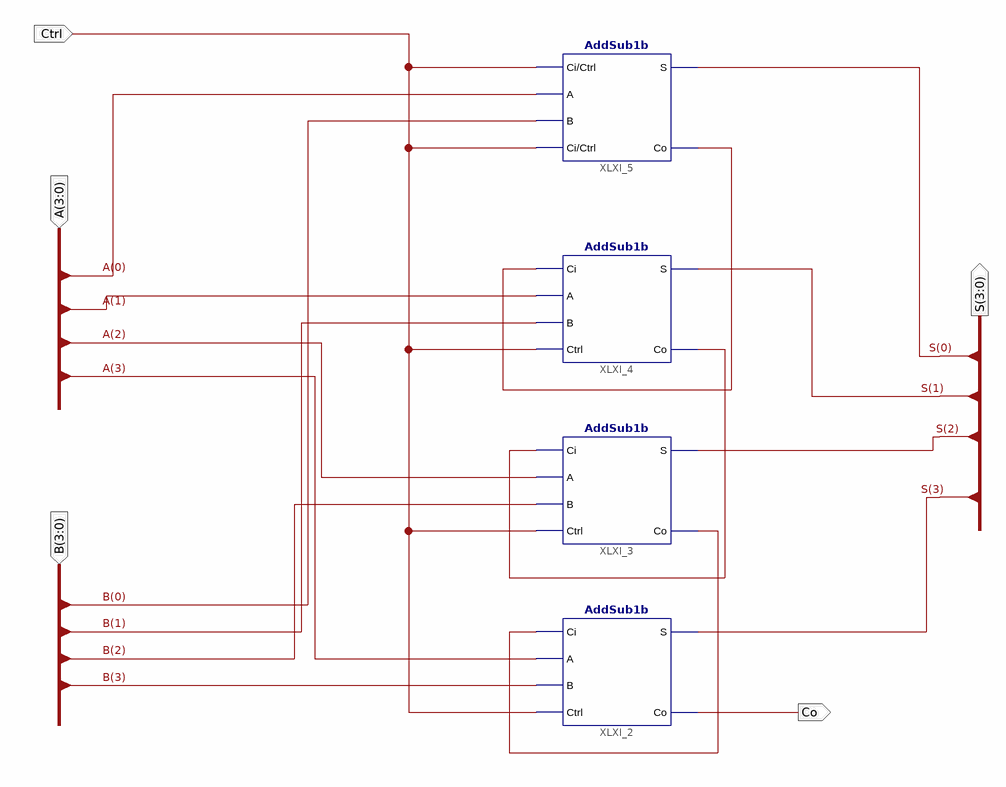
[diagram p0: schematic sheet 1]
// Xilinx ISE schematic AddSub4b.sch (kintex7) as structural Verilog: 4 symbols, 5 ports
module AddSub4b (
  input  [3:0] A,
  input  Ctrl,
  input  [3:0] B,
  output [3:0] S,
  output Co
);

  wire XLXN_24, XLXN_25, XLXN_26;

  AddSub1b XLXI_2 (.Ci(XLXN_26), .A(A[3]), .B(B[3]), .Ctrl(Ctrl), .S(S[3]), .Co(Co));
  AddSub1b XLXI_3 (.Ci(XLXN_25), .A(A[2]), .B(B[2]), .Ctrl(Ctrl), .S(S[2]), .Co(XLXN_26));
  AddSub1b XLXI_4 (.Ci(XLXN_24), .A(A[1]), .B(B[1]), .Ctrl(Ctrl), .S(S[1]), .Co(XLXN_25));
  AddSub1b XLXI_5 (.Ci(Ctrl), .A(A[0]), .B(B[0]), .Ctrl(Ctrl), .S(S[0]), .Co(XLXN_24));
endmodule
